# Altium schematic sheet PGA_Block.SchDoc
size A; SheetNumber: 7; SheetTotal: 16
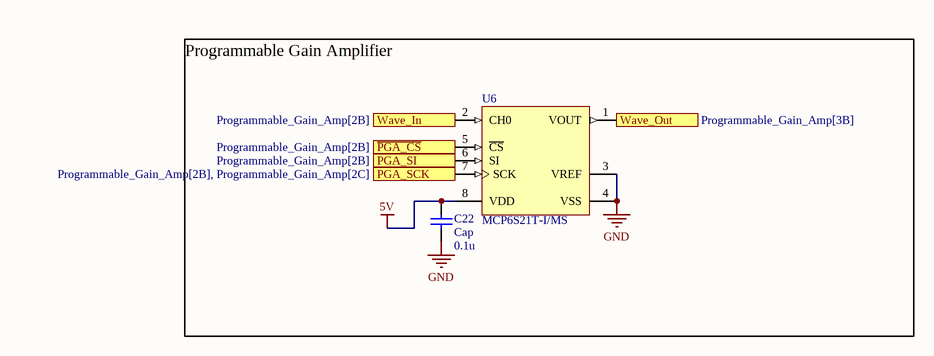
[diagram p0: PGA_Block.SchDoc]

## Parts
C22  Cap  value 0.1u  [0402_Res]
U6  MCP6S21T-I/MS  [MSOP-MS8_N]

## Blocks framed on the sheet
Programmable Gain Amplifier: C22 U6

## Ports
PGA_SCK (in, see Programmable_Gain_Amp[2B], Programmable_Gain_Amp[2C]), PGA_SI (in, see Programmable_Gain_Amp[2B]), Wave_In (in, see Programmable_Gain_Amp[2B]), Wave_Out (out, see Programmable_Gain_Amp[3B]), ~{PGA_CS} (in, see Programmable_Gain_Amp[2B])

## Nets
5V: C22.2 U6.8(VDD)
GND: C22.1 U6.3(VREF) U6.4(VSS)
~{PGA_CS}: U6.5(~{CS}) ; port ~{PGA_CS}
PGA_SCK: U6.7(SCK) ; port PGA_SCK
PGA_SI: U6.6(SI) ; port PGA_SI
Wave_In: U6.2(CH0) ; port Wave_In
Wave_Out: U6.1(VOUT) ; port Wave_Out

## Library data of the parts
C22 = Cap: Capacitor; Published: 8-Jun-2000; LatestRevisionDate: 17-Jul-2002; LatestRevisionNote: Re-released for DXP Platform.; PackageReference: RAD-0.3; Publisher: Altium Limited; PackageDescription: Radial Cap, Thru-Hole; 2 Leads; 0.3 in Pin Spacing
U6 = CMP-0187-00515-2: Single-Ended, Rail-to-Rail Input/Output, Low-Gain Programmable Gain Amplifier, 8-Pin MSOP, Industrial Temperature, Tape and Reel; ComponentLink2Description: Datasheet; RevisionNote: URLs added.; ComponentLink2URL: http://ww1.microchip.com/downloads/en/DeviceDoc/21117a.pdf; PackageDescription: 8-Lead Plastic Micro Small Outline Package (MS) [MSOP]; PackageReference: MSOP-MS8; DatasheetVersion: revA, Mar-2003; ComponentLink1URL: http://www.microchip.com/; ComponentLink3Description: Package Specification; ComponentLink1Description: Manufacturer URL; ComponentLink3URL: http://www.microchip.com/stellent/groups/techpub_sg/documents/packagingspec/en012702.pdf; PackageVersion: revBB, Aug-2009